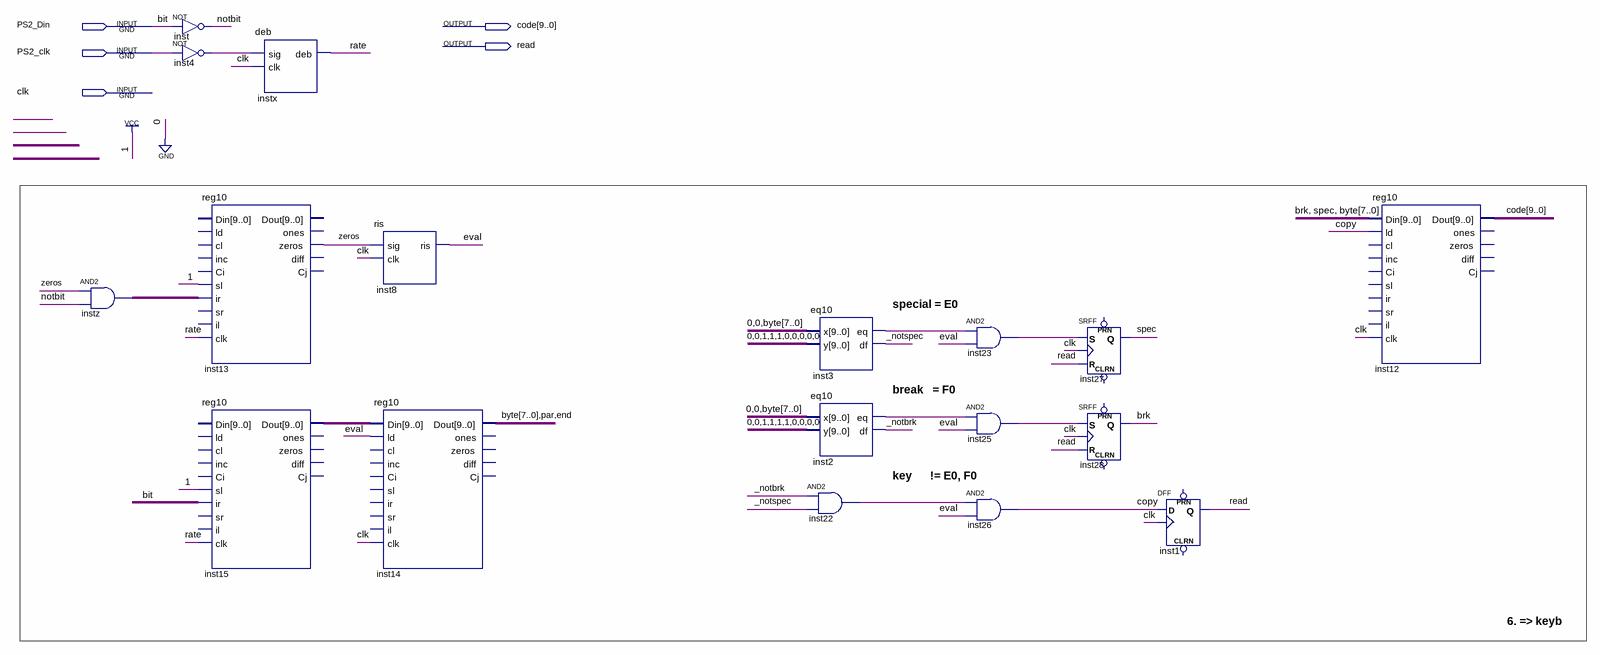
[diagram p0: schematic sheet]
// Quartus schematic KEYBOARD.bdf as structural Verilog: 18 symbols, 5 pins
module KEYBOARD (
  input  PS2_Din,
  input  PS2_clk,
  input  clk,
  output [9:0] code,
  output read
);

  wire _notbrk, _notspec, brk, copy, \end , eval, inst2_eq, inst3_eq, inst4_out, inst22_out, inst23_out,
       inst25_out, instz_out, notbit, par, rate, spec, zeros;
  wire [7:0] \byte ;
  wire [9:0] inst15_dout;

  and instz (instz_out, zeros, notbit);
  not inst (notbit, PS2_Din);
  not inst4 (inst4_out, PS2_clk);
  reg10 inst13 (
    .sl(1'b1), .ir(instz_out), .clk(rate), .zeros(zeros));  // open: Din, ld, cl, inc, Ci, sr, il, Dout, ones, diff, Cj
  reg10 inst15 (
    .sl(1'b1), .ir(PS2_Din), .clk(rate), .Dout(inst15_dout));  // open: Din, ld, cl, inc, Ci, sr, il, ones, zeros, diff, Cj
  deb instx (.sig(inst4_out), .clk(clk), .deb(rate));
  ris inst8 (.sig(zeros), .clk(clk), .ris(eval));
  reg10 inst14 (
    .Din(inst15_dout), .ld(eval), .clk(clk), .Dout({\byte , par, \end }));  // open: cl, inc, Ci, sl, ir, sr, il, ones, zeros, diff, Cj
  eq10 inst3 (.x({2'b00, \byte }), .y(10'b0011100000), .eq(inst3_eq), .df(_notspec));
  eq10 inst2 (.x({2'b00, \byte }), .y(10'b0011110000), .eq(inst2_eq), .df(_notbrk));
  and inst22 (inst22_out, _notbrk, _notspec);
  and inst23 (inst23_out, inst3_eq, eval);
  and inst25 (inst25_out, inst2_eq, eval);
  and inst26 (copy, inst22_out, eval);
  SRFF inst27 (.S(inst23_out), .R(read), .CLK(clk), .Q(spec));  // open: PRN, CLRN
  SRFF inst28 (.S(inst25_out), .R(read), .CLK(clk), .Q(brk));  // open: PRN, CLRN
  DFF inst1 (.CLK(clk), .D(copy), .Q(read));  // open: CLRN, PRN
  reg10 inst12 (
    .Din({brk, spec, \byte }), .ld(copy), .clk(clk), .Dout(code));  // open: cl, inc, Ci, sl, ir, sr, il, ones, zeros, diff, Cj

  // Other names for the same wires on the sheet: bit = PS2_Din

  // Notes on the sheet:
  //   special = E0
  //   break   = F0
  //   key      != E0, F0
  //   6. => keyb
endmodule
